# EAGLE design FixtureMoteino-OSH (EAGLE 7.7.0)
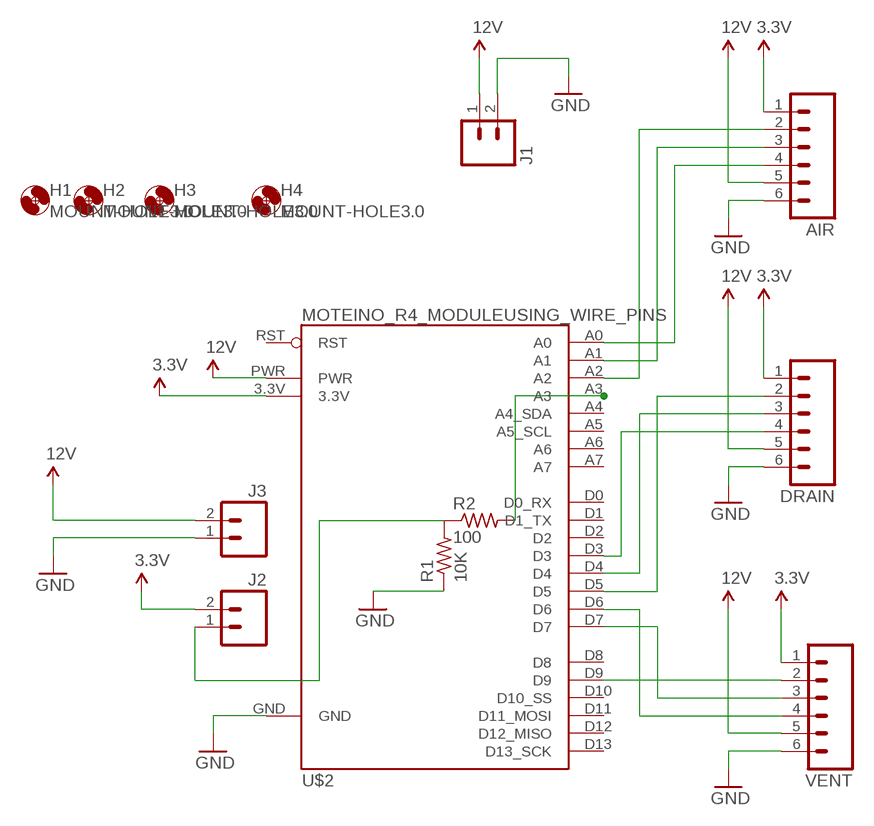
[diagram p0: schematic, sheet 1]

## Parts
AIR  M06LOCK_LONGPADS  [1X06_LOCK_LONGPADS]
DRAIN  M06LOCK_LONGPADS  [1X06_LOCK_LONGPADS]
H1  MOUNT-HOLE3.0  [3,0]
H2  MOUNT-HOLE3.0  [3,0]
H3  MOUNT-HOLE3.0  [3,0]
H4  MOUNT-HOLE3.0  [3,0]
J1  M025MM  [SCREWTERMINAL-5MM-2]
J2  M025MM  [SCREWTERMINAL-5MM-2]
J3  M025MM  [SCREWTERMINAL-5MM-2]
R1  10K  R-US_0207/10  [0207/10]
R2  100  R-US_0207/10  [0207/10]
U$2  MOTEINO_R4_MODULEUSING_WIRE_PINS  [MOTEINO_R4_WIRE]
VENT  M06LOCK_LONGPADS  [1X06_LOCK_LONGPADS]

## Nets
3.3V: AIR.1 DRAIN.1 J2.2 U$2.3.3V VENT.1
12V: AIR.5 DRAIN.5 J1.1 J3.2 U$2.PWR VENT.5
GND: AIR.6 DRAIN.6 J1.2 J3.1 R1.1 U$2.GND VENT.6
N$2: DRAIN.4 U$2.D3
N$3: DRAIN.3 U$2.D4
N$4: DRAIN.2 U$2.D5
N$5: U$2.D6 VENT.4
N$6: J2.1 R1.2 R2.1
N$7: U$2.D7 VENT.3
N$8: U$2.D9 VENT.2
N$9: AIR.4 U$2.A0
N$10: AIR.3 U$2.A1
N$11: AIR.2 U$2.A2
N$15: R2.2 U$2.A3
Unconnected: U$2.A4(A4_SDA) U$2.A5(A5_SCL) U$2.A6 U$2.A7 U$2.D0(D0_RX) U$2.D1(D1_TX) U$2.D2 U$2.D8 U$2.D10(D10_SS) U$2.D11(D11_MOSI) U$2.D12(D12_MISO) U$2.D13(D13_SCK) U$2.RST

## Library data of the parts
AIR DRAIN VENT = SparkFun-Connectors:M06: Header 6 Standard 6-pin 0.1" header. Use with straight break away headers (SKU : PRT-00116), right angle break away headers (PRT-00553), swiss pins (PRT-00743), machine pins (PRT-00117), and female headers (PRT-00115). Molex polarized connector foot print use with SKU : PRT-08094 with associated crimp pins and housings. NOTES ON THE VARIANTS LOCK and LOCK_LONGPADS... This footprint was designed to help hold the alignment of a through-hole component (i.e. 6-pin header) while soldering it into place. You may notice that each hole has been shifted either up or down by 0.005 of an inch from it's more standard position (which is a perfectly straight line). This slight alteration caused the pins (the squares in the middle) to touch the edges of the holes. Because they are alternating, it causes a "brace" to hold the component in place. 0.005 has proven to be the perfect amount of "off-center" position when using our standard breakaway headers. Although looks a little odd when you look at the bare footprint, once you have a header in there, the alteration is very hard to notice. Also,if you push a header all the way into place, it is covered up entirely on the bottom side. This idea of altering the position of holes to aid alignment will be further integrated into the Sparkfun Library for other footprints. It can help hold any component with 3 or more connection pins.
H1-H4 = holes:MOUNT-HOLE: MOUNTING HOLE with drill center marker
J1-J3 = SparkFun-Connectors:M02: Standard 2-pin 0.1" header. Use with - straight break away headers ( PRT-00116) - right angle break away headers (PRT-00553) - swiss pins (PRT-00743) - machine pins (PRT-00117) - female headers (PRT-00115) Molex polarized connector foot print use with: PRT-08233 with associated crimp pins and housings. 2.54_SCREWTERM for use with PRT-10571. 3.5mm Screw Terminal footprints for PRT-08084 5mm Screw Terminal footprints for use with PRT-08432; STOREFRONT_ID: PRT-08432
R1 R2 = resistor:R-US_: RESISTOR, American symbol
U$2 = MoteinoR4Mod:MOTEINO_R4_MODULE: Moteino Module as a device. Available in two footprints, one with pads for 0.025" sq pins, and one using wire pins.

## Net classes
0 default: width 0.406 mm, drill 0.406 mm, clearance 0.406 mm

## Board
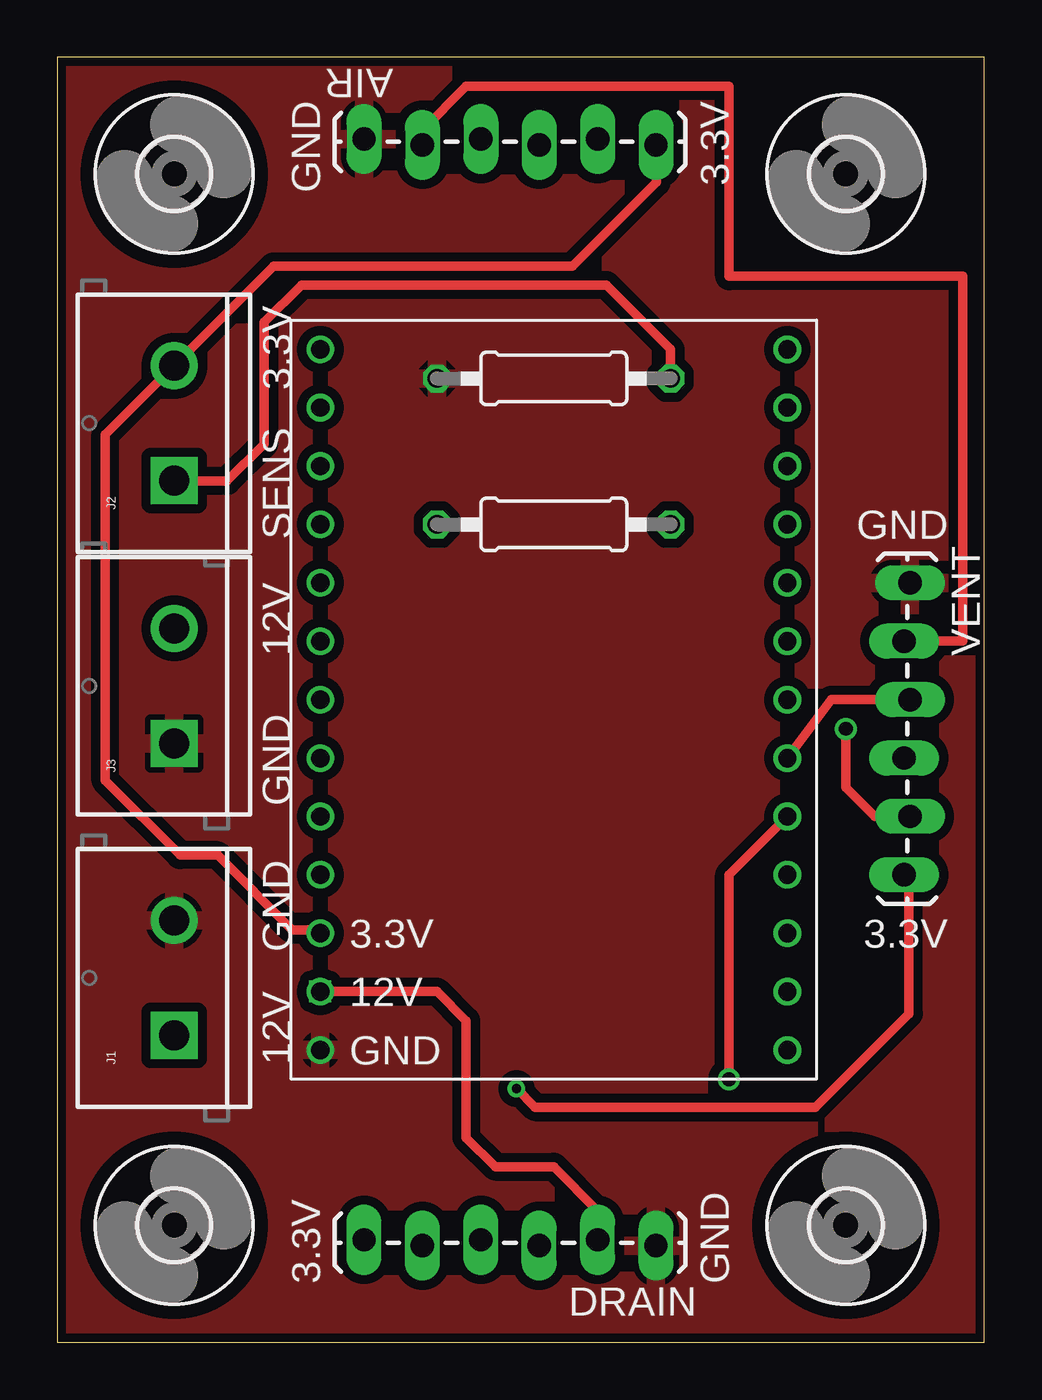
[diagram p1: board, top side]
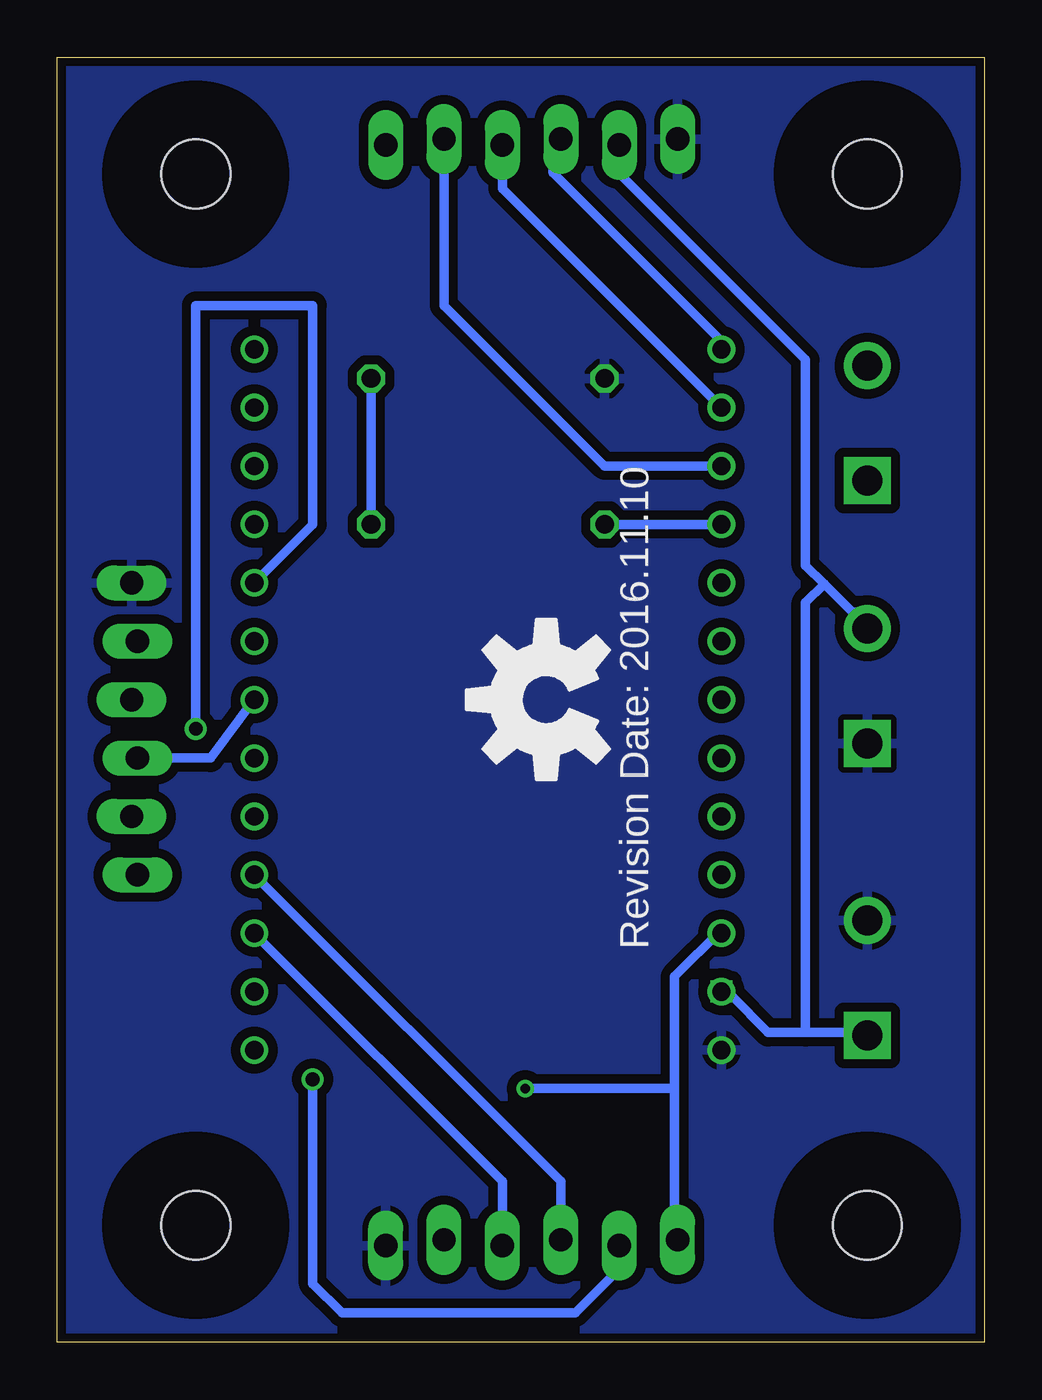
[diagram p2: board, bottom side, seen from below]

Size 40.31 x 55.87 mm. Coordinates in mm from the lower left corner, seen from the top.
Outline: 0,0 40.31,0 40.31,55.87 0,55.87 0,0
Copper layers (1*16): Top 0.0356mm / dielectric 1.5011mm / Bottom 0.0356mm
Design rules "LaenPCBOrder": minimum track width 6mil, minimum drill 13mil, track to track 6mil, track to pad 6mil, pad to pad 6mil, via to via 6mil, smd to smd 6mil, copper to edge 15mil, drill to drill 6mil, minimum pad ring 7mil, minimum via ring 7mil, stop-mask expansion 3mil, vias tented up to drill 0mil, thermal gap 10mil

### Footprints (pad centres in the part's own frame; a part is rotated, then mirrored left to right if it is on the bottom)
1X06_LOCK_LONGPADS = drill 1.016 long: 1 0,0; 2 2.54,-0.254; 3 5.08,0; 4 7.62,-0.254; 5 10.16,0; 6 12.7,-0.254
3,0 = hole 3: 0,0
SCREWTERMINAL-5MM-2 = drill 1.3 pad 2.032 square: 1 0,0 | drill 1.3 pad 2.032: 2 5,0
0207/10 = drill 0.813 octagon: 1 -5.08,0; 2 5.08,0
MOTEINO_R4_WIRE = drill 0.8: 3.3V -10.16,8.89; A0 15.24,8.89; A1 12.7,8.89; A2 10.16,8.89; A3 7.62,8.89; A4 5.08,8.89; A5 2.54,8.89; A6 0,8.89; A7 -2.54,8.89; D0 -5.08,8.89; D1 -7.62,8.89; D2 -12.7,-11.43; D3 -10.16,-11.43; D4 -7.62,-11.43; D5 -5.08,-11.43; D6 -2.54,-11.43; D7 0,-11.43; D8 2.54,-11.43; D9 5.08,-11.43; D10 7.62,-11.43; D11 10.16,-11.43; D12 12.7,-11.43; D13 15.24,-11.43; GND -15.24,8.89; PWR -12.7,8.89; RST -15.24,-11.43

### Placement (x,y rotation side)
AIR  26.03,52.07 180 top
DRAIN  13.34,4.45 0 top
H1  5.08,5.08 0 top
H2  34.29,5.08 0 top
H3  34.29,50.8 0 top
H4  5.08,50.8 0 top
J1  5.08,13.33 90 top
J2  5.08,37.47 90 top
J3  5.08,26.04 90 top
R1  21.59,41.91 0 top
R2  21.59,35.56 180 top
U$1  [OSHW-LOGO-L]  19.05,27.94 90 bottom
U$2  20.32,27.94 90 top
VENT  36.83,20.32 90 top

### Tracks (layer width: path | path; a pad name or v marks a point on that pad's centre or on a via)
3.3V  (via drill 0.41)
  Top 0.406: AIR.1 26.06,52.07 26.06,50.44 22.4,46.79 9.4,46.79 9.4,46.78 J2.2 2.09,39.47 2.08,39.47 2.08,24.43 5.33,21.18 6.96,21.18 10.21,17.93 11.43,17.93 U$2.3.3V | v19.96,11.02 20.78,10.21 32.97,10.21 37.03,14.28 37.03,19.96 VENT.1
  Bottom 0.406: U$2.3.3V 11.43,17.93 13.46,15.9 13.46,11.02 | 13.46,11.02 v19.96,11.02 | 13.46,11.02 13.46,4.57 DRAIN.1
12V  (via drill 0.6)
  Top 0.406: U$2.PWR 16.51,15.24 17.78,13.97 17.78,8.89 19.05,7.62 21.59,7.62 23.49,5.71 DRAIN.5 | VENT.5 39.37,30.48 39.37,46.36 29.21,46.36 29.21,54.61 17.78,54.61 15.88,52.7 AIR.5
  Bottom 0.406: 6.96,32.97 5.74,31.75 5.33,31.75 4.93,31.34 J3.2 | 6.96,32.97 7.77,33.78 7.77,42.72 15.9,50.85 15.9,52.07 AIR.5 | 7.77,13.46 5.33,13.46 J1.1 | 7.77,13.46 9.4,13.46 11.02,15.09 11.43,15.09 U$2.PWR | 6.96,32.97 7.77,32.16 7.77,13.46
  other vias: 11.43,15.24
GND
  pour Top: 0,55.88 40.64,55.88 40.64,0 0,0
  pour Bottom: 0,55.88 40.64,55.88 40.64,0 0,0
N$2
  Bottom 0.406: DRAIN.4 20.95,6.98 U$2.D3
N$3
  Bottom 0.406: DRAIN.3 18.41,6.98 U$2.D4
N$4  (via drill 0.6)
  Top 0.406: v29.21,11.43 29.21,20.32 U$2.D5
  Bottom 0.406: DRAIN.2 15.88,3.18 17.78,1.27 27.94,1.27 29.21,2.54 v29.21,11.43
N$5
  Top 0.406: U$2.D6 33.66,27.94 VENT.4
N$6
  Top 0.406: J2.1 5.33,37.44 7.37,37.44 8.99,39.06 8.99,44.35 10.62,45.97 23.88,45.97 26.67,43.18 R1.2
  Bottom 0.406: R2.1 R1.2
N$7
  Bottom 0.406: U$2.D7 33.66,25.4 VENT.3
N$8  (via drill 0.6)
  Top 0.406: v34.29,26.67 34.29,24.13 35.56,22.86 VENT.2
  Bottom 0.406: U$2.D9 29.21,35.56 29.21,45.09 34.29,45.09 v34.29,26.67
N$9
  Bottom 0.406: U$2.A0 11.43,43.54 18.75,50.85 18.75,52.07 AIR.4
N$10
  Bottom 0.406: U$2.A1 20.95,50.17 AIR.3
N$11
  Bottom 0.406: U$2.A2 16.51,38.1 23.49,45.09 AIR.2
N$15
  Bottom 0.406: U$2.A3 R2.2

### Text on the board
tNames: GND | 3.3V | 3.3V | GND | SENS | 12V | GND | GND | 3.3V | 3.3V | 12V | 12V | GND | 3.3V | GND
bNames: Revision Date: 2016.11.10